# Altium schematic sheet Power_XC6220B_5V.SchDoc
size 297 x 209 mm; SheetNumber: 11; SheetTotal: 12
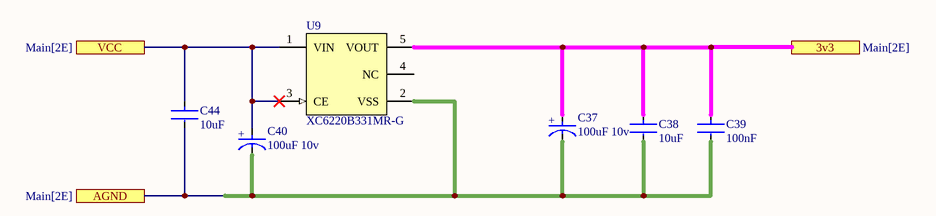
[diagram p0: Power_XC6220B_5V.SchDoc]

## Parts
C37  100uF 10v  [CAP-ALUM_5*5.4mm]
C38  10uF  [CAP-0603]
C39  100nF  [CAP-0603]
C40  100uF 10v  [CAP-ALUM_5*5.4mm]
C44  10uF  [CAP-0603]
U9  XC6220B331MR-G  [TORX-SOT-25-5_M]

## Ports
3v3 (see Main[2E]), AGND (see Main[2E]), VCC (see Main[2E])

## Nets
3v3: C37.2(A) C38.1 C39.1 U9.5(VOUT) ; port 3v3
AGND: C37.1(C) C38.2 C39.2 C40.1(C) C44.2 U9.2(VSS) ; port AGND
VCC: C40.2(A) C44.1 U9.1(VIN) U9.3(CE) ; port VCC

Not connected (* = marked no-connect by the designer): U9 4(NC)

## Notes on the sheet
- Title
- Size:
- Date:
- A4
- Variant :
- Time:
- Sheet
- Revision:
- of
- Company Link :
- Designer:
- Designer Link:
- www.fatehscan.com
- File:
- (in symbol CAP-ALUM) +

## Library data of the parts
C37 C40 = CAP-ALUM: CAP ALUM SMD; Life (Hours): 2000Hour; Lead Length: 2.2mm; Voltage Rating: 35V; Ripple Current (AC): 30mA; Leakage Current: 3uA; Tolerance: 20%; Length: 5.5mm; Construction: Cylindrical; Diameter: 5mm; RoHS Compliant: Yes; REACH SVHC: No SVHC; value: 100uF 10v; Max Operating Temperature: 85°C; Series: S; Case/Package: Radial; Contact Plating: Tin; Packaging: Tape and Reel; Number of Pins: 2; Height: 5.4mm; Width: 5.3mm; Voltage Rating (DC): 35V; Mount: Surface Mount; Lead Pitch: 1.5mm; Radiation Hardening: No; Height - Seated (Max): 0.213inch; Ripple Current: 30mA; Voltage: 35V; Package Quantity: 1; Termination: SMD/SMT; Min Operating Temperature: -40°C
C38 C39 C44 = CAP-Ceramic: Chip Multilayer Ceramic Capacitors for General Purpose, 0603; Voltage Rating (DC): 6.3V; Dielectric: X5R; Tolerance: 20%; Packaging: Tape and Reel; Width: 0.031inch; Termination: SMD/SMT; Package Quantity: 4000; Voltage Rating: 6.3V; Case/Package: 0603; Min Operating Temperature: -55°C; Voltage: 6.3V; Length: 1.6mm; Thickness: 0.035inch; Lead Free: Lead Free; Depth: 0.8mm; Case Code (Imperial): 0603; Max Operating Temperature: 85°C; Material: Ceramic; Height: 0.8mm; Mount: Surface Mount; REACH SVHC: No SVHC; Radiation Hardening: No; Case Code (Metric): 1608
  C38 C44: Capacitance: 10uF
  C39: Capacitance: 100nF
U9 = CMP-0599-00001-2: 1A LDO Voltage Regulator with CL discharge, 3.3 V, 1000 mA, -45 to 85 degC, 5-Pin SOT-25, RoHS, Reel; Manufacturer: Torex; Output Voltage: 3.3 V; Maximum Output Current: 1000 mA; ComponentLink1Description: Manufacturer URL; ComponentLink2URL: http://www.torex.co.jp/english/products/voltage_regulators/data/XC6220.pdf; DatasheetVersion: ETR0341-010a; ComponentLink1URL: http://www.torex.co.jp/; Mounting Technology: Surface Mount; Operating Ambient Temperature: -40 to 85 degC; PackageReference: SOT-25-5; PackageDescription: 5-Pin Small Out-Line Transistor, Body 2.9 x 1.65 mm, Pitch 0.95 mm; PartNumber: XC6220B331MR-G; RoHS: TRUE; Packing: Reel; ComponentLink2Description: Datasheet